# Altium schematic sheet POWER INPUT.SchDoc
size A2; DocumentNumber: 5; SheetNumber: 5; SheetTotal: 19
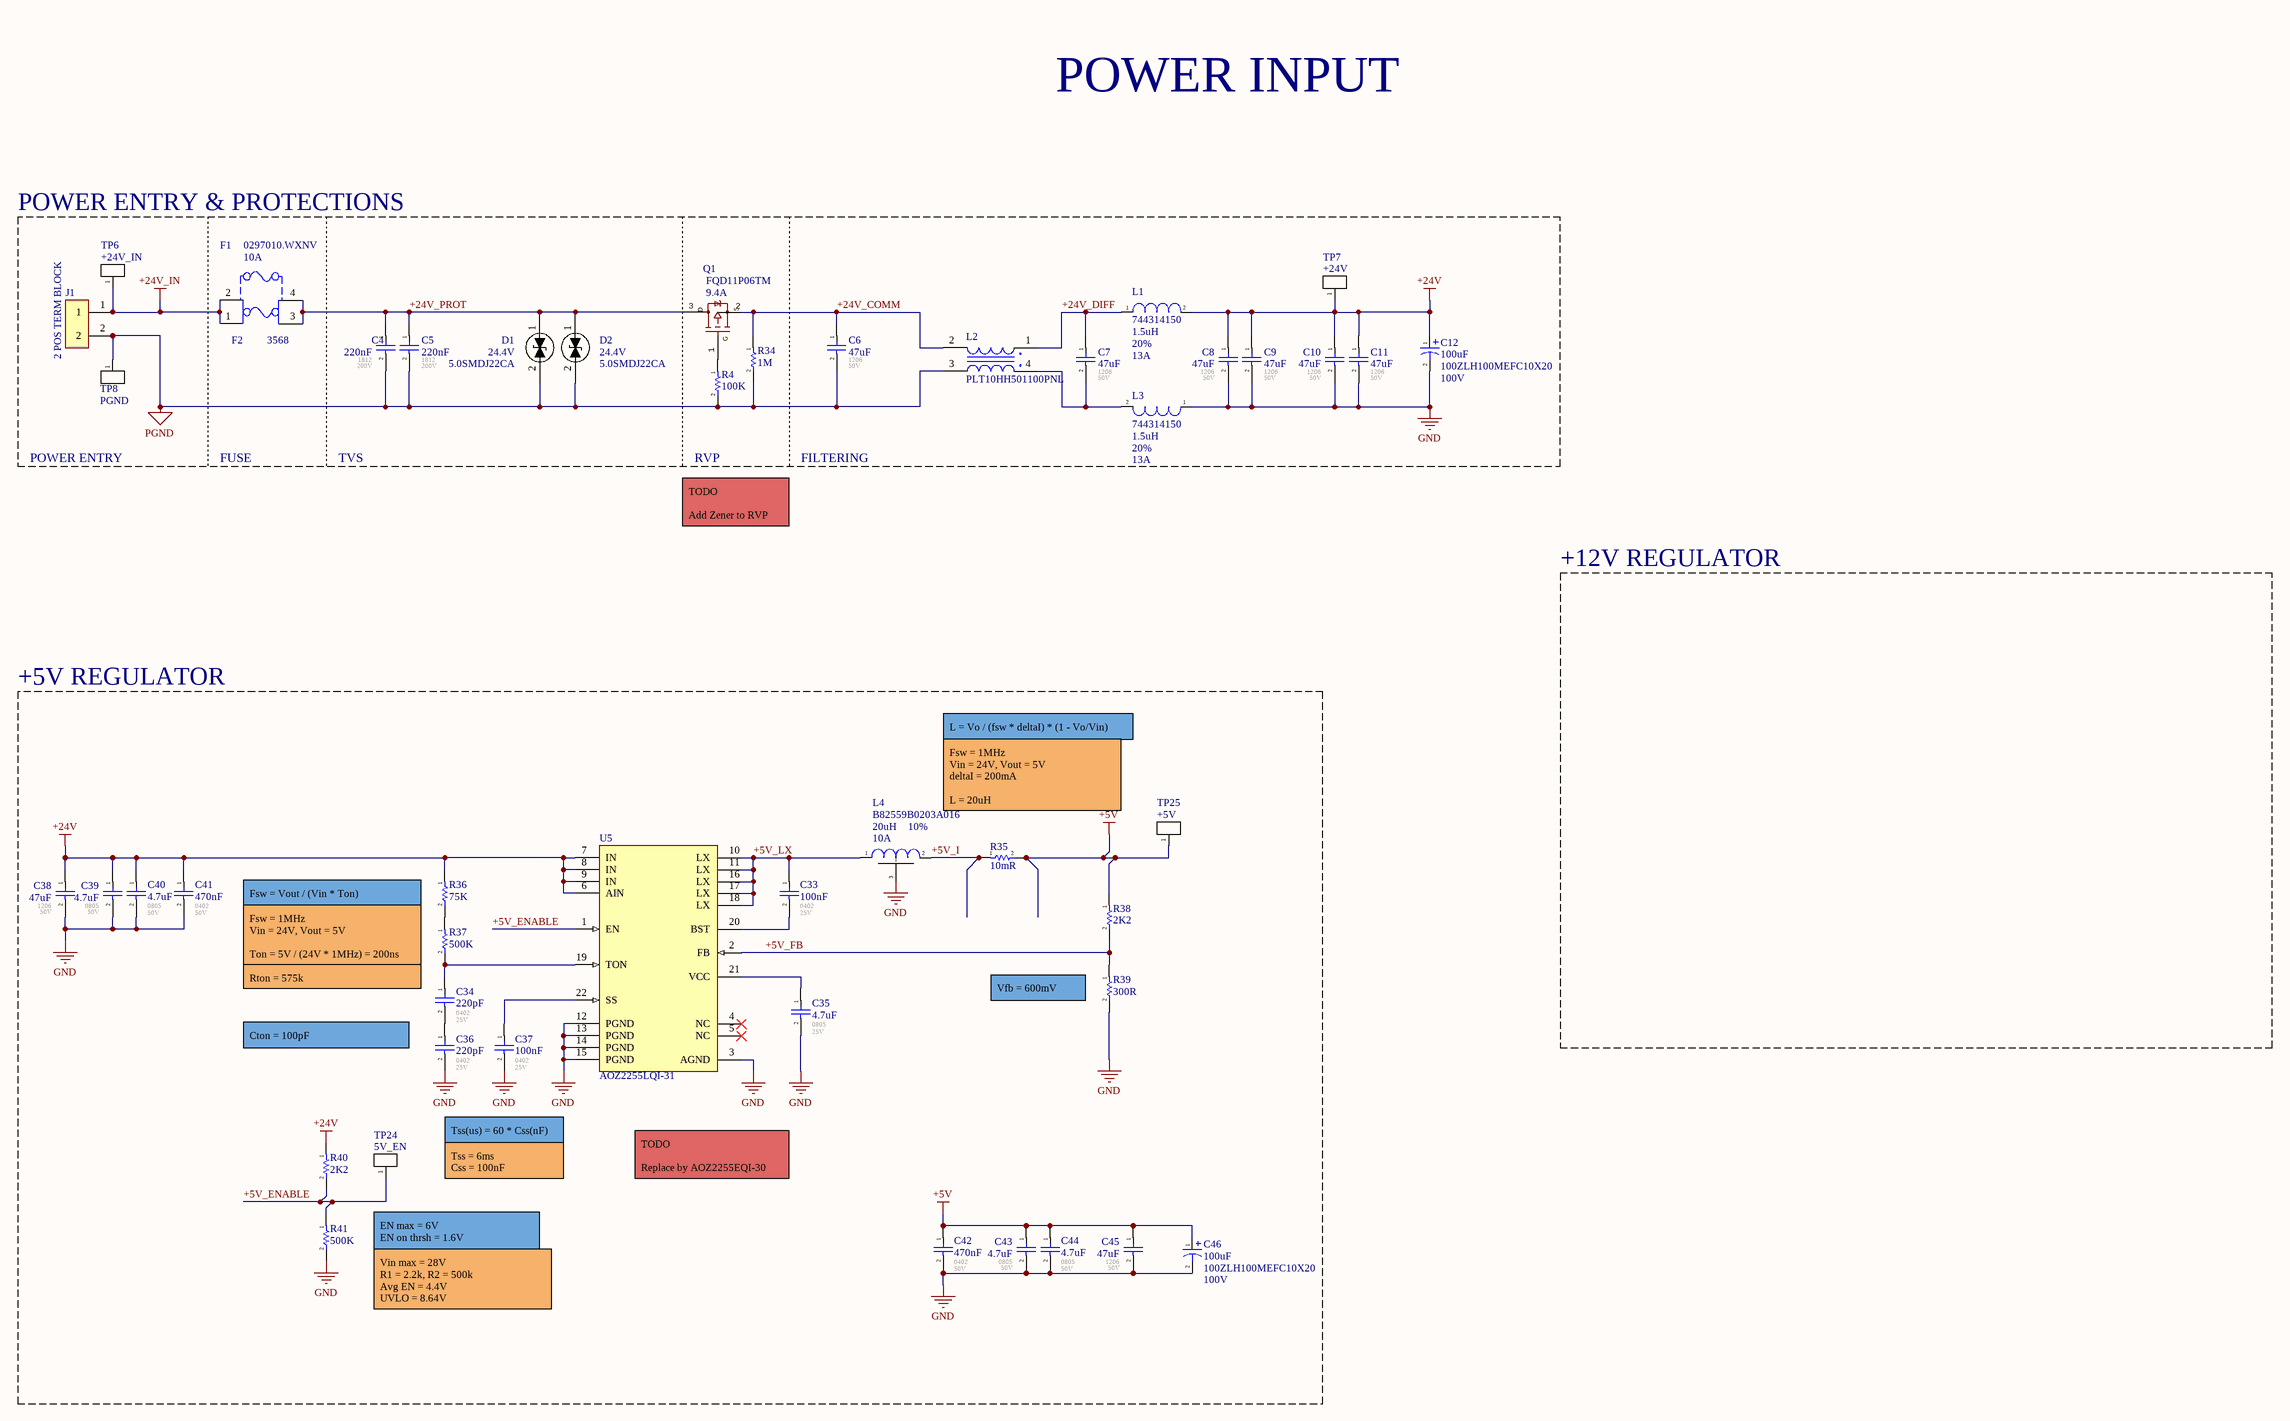
[diagram p0: POWER INPUT.SchDoc]

## Parts
C4  220nF  Voltage - Rated: 200V  Footprint: 1812  [CAP_1812]
C5  220nF  Voltage - Rated: 200V  Footprint: 1812  [CAP_1812]
C6  47uF  Footprint: 1206  Voltage - Rated: 50V  [CAP_1206]
C7  47uF  Footprint: 1206  Voltage - Rated: 50V  [CAP_1206]
C8  47uF  Footprint: 1206  Voltage - Rated: 50V  [CAP_1206]
C9  47uF  Footprint: 1206  Voltage - Rated: 50V  [CAP_1206]
C10  47uF  Footprint: 1206  Voltage - Rated: 50V  [CAP_1206]
C11  47uF  Footprint: 1206  Voltage - Rated: 50V  [CAP_1206]
C12  100uF  Rated Voltage: 100V  [100ZLH100MEFC10X20]
C33  100nF  Footprint: 0402  Voltage - Rated: 25V  [CAP_0402]
C34  220pF  Footprint: 0402  Voltage - Rated: 25V  [CAP_0402]
C35  4.7uF  Footprint: 0805  Voltage - Rated: 25V  [CAP_0805]
C36  220pF  Footprint: 0402  Voltage - Rated: 25V  [CAP_0402]
C37  100nF  Footprint: 0402  Voltage - Rated: 25V  [CAP_0402]
C38  47uF  Footprint: 1206  Voltage - Rated: 50V  [CAP_1206]
C39  4.7uF  Footprint: 0805  Voltage - Rated: 50V  [CAP_0805]
C40  4.7uF  Footprint: 0805  Voltage - Rated: 50V  [CAP_0805]
C41  470nF  Footprint: 0402  Voltage - Rated: 50V  [CAP_0402]
C42  470nF  Footprint: 0402  Voltage - Rated: 50V  [CAP_0402]
C43  4.7uF  Footprint: 0805  Voltage - Rated: 50V  [CAP_0805]
C44  4.7uF  Footprint: 0805  Voltage - Rated: 50V  [CAP_0805]
C45  47uF  Footprint: 1206  Voltage - Rated: 50V  [CAP_1206]
C46  100uF  Rated Voltage: 100V  [100ZLH100MEFC10X20]
D1  5.0SMDJ22CA  Voltage - Breakdown: 24.4V  [DO214AB (SMC)]
D2  5.0SMDJ22CA  Voltage - Breakdown: 24.4V  [DO214AB (SMC)]
F1  0297010.WXNV  Current - Trip: 10A  [0297010.WXNV]
F2  3568  [3568]
J1  2 POS TERM BLOCK  [TERM-2_90_100MIL]
L1  744314150  Inductance: 1.5uH  Tolerance: 20%  Current Rating: 13A  [744314150]
L2  PLT10HH501100PNL  [PLT10HH501100PNL]
L3  744314150  Inductance: 1.5uH  Tolerance: 20%  Current Rating: 13A  [744314150]
L4  B82559B0203A016  Inductance: 20uH  Tolerance: 10%  Current Rating: 10A  [B82559B0203A016]
Q1  FQD11P06TM  Current: 9.4A  [FQD11P06TM]
R4  100K  [RES_0603]
R34  1M  [RES_0402]
R35  10mR  [RES_2512]
R36  75K  [RES_0402]
R37  500K  [RES_0402]
R38  2K2  [RES_0603]
R39  300R  [RES_0603]
R40  2K2  [RES_0603]
R41  500K  [RES_0402]
TP6  +24V_IN  [TP_HOLE]  (no BOM)
TP7  +24V  [TP_HOLE]  (no BOM)
TP8  PGND  [TP_HOLE]  (no BOM)
TP24  5V_EN  [TP_PAD_SMALL]  (no BOM)
TP25  +5V  [TP_HOLE]  (no BOM)
U5  AOZ2255LQI-31  [AOZ2255LQI-31]

## Blocks framed on the sheet
POWER ENTRY & PROTECTIONS: C4-C12 D1 D2 F1 F2 J1 L1-L3 Q1 R4 R34 TP6-TP8
+5V REGULATOR: C33-C46 L4 R35-R41 TP24 TP25 U5

## Nets
+5V: C42.1 C43.1 C44.1 C45.1 C46.1 R35.2 R38.1 TP25.1(A)
+24V: C8.1 C9.1 C10.1 C11.1 C12.1 C38.1 C39.1 C40.1 C41.1 L1.2 R36.1 R40.1 TP7.1(A) U5.6(AIN) U5.7(IN) U5.8(IN) U5.9(IN)
+24V_IN: F2.1 F2.2 J1.1 TP6.1(A)
GND: C8.2 C9.2 C10.2 C11.2 C12.2 C35.2 C36.2 C37.2 C38.2 C39.2 C40.2 C41.2 C42.2 C43.2 C44.2 C45.2 C46.2 L3.1 L4.3(SHIELD) R39.2 R41.2 U5.3(AGND) U5.12(PGND) U5.13(PGND) U5.14(PGND) U5.15(PGND)
PGND: C4.2 C5.2 C6.2 D1.2(C) D2.2(C) J1.2 L2.3 R4.2 R34.2 TP8.1(A)
+5V_ENABLE: R40.2 R41.1 TP24.1(A) U5.1(EN)
+5V_FB: R38.2 R39.1 U5.2(FB)
+5V_I: L4.2 R35.1
+5V_LX: C33.1 L4.1 U5.10(LX) U5.11(LX) U5.16(LX) U5.17(LX) U5.18(LX)
+24V_COMM: C6.1 L2.2 Q1.2(S) R34.1
+24V_DIFF: C7.1 L1.1 L2.1
+24V_PROT: C4.1 C5.1 D1.1(A) D2.1(A) F2.3 F2.4 Q1.3(D)
NetC7_2: C7.2 L2.4 L3.2
NetC33_2: C33.2 U5.20(BST)
NetC34_1: C34.1 R37.2 U5.19(TON)
NetC34_2: C34.2 C36.1
NetC35_1: C35.1 U5.21(VCC)
NetC37_1: C37.1 U5.22(SS)
NetQ1_1: Q1.1(G) R4.1
NetR36_2: R36.2 R37.1

Not connected (* = marked no-connect by the designer): U5 4(NC)* 5(NC)*

## Notes on the sheet
- POWER INPUT
- POWER ENTRY
- FUSE
- TVS
- RVP
- FILTERING
- TODO
  Add Zener to RVP
- +12V REGULATOR
- L = Vo / (fsw * deltaI) * (1 - Vo/Vin)
- Fsw = 1MHz
  Vin = 24V, Vout = 5V
  deltaI = 200mA
  L = 20uH
- Fsw = Vout / (Vin * Ton)
- Fsw = 1MHz
  Vin = 24V, Vout = 5V
  Ton = 5V / (24V * 1MHz) = 200ns
- Rton = 575k
- (near R39) Vfb = 600mV
- Cton = 100pF
- Tss(us) = 60 * Css(nF)
- Tss = 6ms
  Css = 100nF
- TODO
  Replace by AOZ2255EQI-30
- EN max = 6V
  EN on thrsh = 1.6V
- Vin max = 28V
  R1 = 2.2k, R2 = 500k
  Avg EN = 4.4V
  UVLO = 8.64V

## Library data of the parts
C4-C11 C33-C45 = CAP_CER: Generic SMT Ceramic Capacitor; Operating Temperature: *; Tolerance: *; Mfr: *; ComponentLink1Description: Digikey; ComponentLink1URL: [Digikey Link]; Digikey Part No: *; ComponentLink2Description: Datasheet; ComponentLink2URL: [Datasheet Link]
C12 C46 = CAP_100ZLH100MEFC10X20: CAP 100uF 20% 100V T/H; Mfr: Rubycon; Impedance: 120mR; Tolerance: 20%; Operating Temperature: -40C - 105C; ComponentLink1Description: Digikey; ComponentLink1URL: https://www.digikey.ca/en/products/detail/rubycon/100ZLH100MEFC10X20/3563824; ComponentLink2Description: Mouser; ComponentLink2URL: https://www.mouser.ca/ProductDetail/Rubycon/100ZLH100MEFC10X20; Digikey Part Number: 1189-1887-ND; Created By: Pascal-Emmanuel Lachance; ComponentLink3Description: Datasheet; ComponentLink3URL: https://www.rubycon.co.jp/wp-content/uploads/catalog-aluminum/ZLH.pdf; ComponentLink4Description: Octoparts; ComponentLink4URL: https://octopart.com/100zlh100mefc10x20-rubycon-19941711; Height: 22mm; Manufacturer Part Number: 100ZLH100MEFC10X20
D1 D2 = DIODE_5.0SMDJ22CA: TVS Diode 24.4V; Mfr: Littelfuse; Voltage - Reverse: 22V; Current: 141A Peak; Operating Temperature: -65C - 150C; Package / Case: SMC; Created By: Pascal-Emmanuel Lachance; ComponentLink1Description: Datasheet; ComponentLink1URL: https://www.littelfuse.com/~/media/electronics/datasheets/tvs_diodes/littelfuse_tvs_diode_5_0smdj_datasheet.pdf.pdf; ComponentLink2Description: Mfr page; ComponentLink2URL: https://www.littelfuse.com/products/tvs-diodes/surface-mount/5_0smdj/5_0smdj22ca.aspx; ComponentLink3Description: Digikey; ComponentLink3URL: https://www.digikey.ca/en/products/detail/littelfuse-inc/5-0SMDJ22CA/2024320; ComponentLink4Description: Mouser; ComponentLink4URL: https://www.mouser.ca/ProductDetail/Littelfuse/50SMDJ22CA; Supplier 1: Digi-Key; Supplier 2: Mouser; Supplier Part Number 1: F10850CT-ND; Supplier Part Number 2: 652-5.0SMDJ22CA
F1 = FUSE_0297010.WXNV: FUSE AUTO 10A 32V BLADE MINI; Mfr: Littelfuse; Current - Max: 40A; Time to Trip: 100ms; Resistance: 7.42mR; Rule: UNIONINDEX=0|RULEKIND=ComponentClearance|NETSCOPE=AnyNet|LAYERKIND=SameLayer|NAME=Schematic Component Clearance Constraint|GAP=-1mil|COLLISIONCHECKMODE=3|VERTICALGAP=10mil|SHOWDISTANCES=FALSE|UNIT=Imperial; Voltage Rating: 32V; Operating Temperature: -40C - 125C; Package / Case: BLADE MINI AUTO; Current - Hold: 10A; ComponentLink1Description: Datasheet; ComponentLink1URL: https://www.littelfuse.com/~/media/automotive/datasheets/fuses/passenger-car-and-commercial-vehicle/blade-fuses/littelfuse_mini_datasheet.pdf; ComponentLink2Description: Digikey; ComponentLink2URL: https://www.digikey.ca/en/products/detail/littelfuse-inc/0297010-WXNV/146591; Created By: Pascal-Emmanuel Lachance; ComponentLink3Description: Mouser; ComponentLink3URL: https://www.mouser.ca/ProductDetail/Littelfuse/0297010WXNV; ComponentLink4Description: Octopart; ComponentLink4URL: https://octopart.com/0297010.wxnv-littelfuse-566872
F2 = FUSE_HOLDER_3568: FUSE HOLDER BLADE; Mfr: Keystone; Voltage Rating: 500V; Current - Max: 30A; Operating Temperature: -50C - 145C; Created By: Pascal-Emmanuel Lachance
J1 = TERM_BLOCK-2
L1 L3 = IND_744314150: FIXED IND 1.5UH 13A 4.3 MOHM SMD; Mfr: Wurth; Resistance: 4.3mR; Operating Temperature: -40C - 150C; Created By: Pascal-Emmanuel Lachance; ComponentLink1Description: Digikey; ComponentLink1URL: https://www.digikey.ca/en/products/detail/w%C3%BCrth-elektronik/744314150/1638563; ComponentLink2Description: Mouser; ComponentLink2URL: https://www.mouser.ca/ProductDetail/Wurth-Elektronik/744314150; ComponentLink3Description: Datasheet; ComponentLink3URL: https://www.we-online.com/katalog/datasheet/744314150.pdf
L2 = IND_PLT10HH501100PNL: 2 Line Common Mode Choke Surface Mount 500 Ohms @ 10MHz 10A DCR 4.1mOhm; mfr: Murata; Impedance @ 10MHz: 500R; DC Resistance: 4.1mR; Voltage Rating: 100V; Rating: Automotive (AEC-Q200); Value: *; Current Rating: 10A; Operating Temperature: -55C - 105C; Created By: Pascal-Emmanuel Lachance; ComponentLink1Description: Datasheet; ComponentLink1URL: https://www.murata.com/en-eu/products/productdata/8796754935838/QFLB9101.pdf; ComponentLink2Description: Mfr page; ComponentLink2URL: https://www.murata.com/en-us/products/productdetail?partno=PLT10HH501100PN%23; ComponentLink3Description: Digikey; ComponentLink3URL: https://www.digikey.ca/en/products/detail/murata-electronics/PLT10HH501100PNL/6196056; ComponentLink4Description: Mouser; ComponentLink4URL: https://www.mouser.ca/ProductDetail/Murata-Electronics/PLT10HH501100PNL
L4 = IND_B82559B0203A016: 20uH Shielded 10A Inductor; Mfr: TDK; Material: Ferrite; Resistance: 12.1mR; Operating Temperature: -40C to 150C; Created By: Pascal-Emmanuel Lachance; Rating: AEC-Q200; ComponentLink1Description: Datasheet; ComponentLink1URL: https://media.digikey.com/pdf/Data%20Sheets/TDK%20PDFs/B82559BxA016_Series_DS.pdf; ComponentLink2Description: Digikey; ComponentLink2URL: https://www.digikey.ca/en/products/detail/epcos-tdk-electronics/B82559B0203A016/13165560; ComponentLink3Description: Mouser; ComponentLink3URL: https://www.mouser.ca/ProductDetail/EPCOS-TDK/B82559B0203A016; ComponentLink4Description: Mfr page; ComponentLink4URL: https://product.tdk.com/en/search/inductor/inductor/smd/info?part_no=B82559B0203A016; ComponentLink5Description: Octoparts; ComponentLink5URL: https://octopart.com/b82559b0203a016-epcos-111982021; Supplier 1: Digi-Key; Supplier Part Number 1: 495-B82559B0203A016CT-ND
Q1 = TRANS_FQD11P06TM: MOSFET P-CH 60V 9.4A DPAK; Mfr: ON Semiconductor; Rds ON: 185mOhms; Vgs: +-30V; Package / Case: DPAK; Vds: 60V; Operating Temperature: -55C - 150C; Digikey Part Number: FQD11P06TMCT-ND; ComponentLink1Description: Digikey; ComponentLink1URL: https://www.digikey.ca/en/products/detail/on-semiconductor/FQD11P06TM/1054286; ComponentLink2Description: Mouser; ComponentLink2URL: https://www.mouser.ca/ProductDetail/ON-Semiconductor-Fairchild/FQD11P06TM
R4 R34 = RESISTOR: Power: 1/16W; Tolerance: 10%; Automotive: *; Operating Temperature: *; # Digikey: *; ComponentLink1Description: Digikey; ComponentLink1URL: *; # Manufacturer: *; Package / Case: 0603
R35 = RESISTOR: Power: 2W; Tolerance: 1%; Automotive: *; Operating Temperature: *; # Digikey: *; ComponentLink1Description: Digikey; ComponentLink1URL: *; # Manufacturer: *; Package / Case: 2512
R36 R37 R41 = RESISTOR: Power: 1/10W; Tolerance: 10%; Automotive: *; Operating Temperature: *; # Digikey: *; ComponentLink1Description: Digikey; ComponentLink1URL: *; # Manufacturer: *; Package / Case: 0402
R38 R40 = RESISTOR: Power: 1/16W; Tolerance: 2%; Automotive: *; Operating Temperature: *; # Digikey: *; ComponentLink1Description: Digikey; ComponentLink1URL: *; # Manufacturer: *; Package / Case: 0603
R39 = RESISTOR: Power: 1/8W; Tolerance: 2%; Automotive: *; Operating Temperature: *; # Digikey: *; ComponentLink1Description: Digikey; ComponentLink1URL: *; # Manufacturer: *; Package / Case: 0603
TP6-TP8 TP24 TP25 = TESTPOINT: Test Point
U5 = IC_AOZ2255LQI-31: Buck Switching Regulator IC Positive Adjustable 0.6V 1 Output 12A 22-PowerVFQFN; Mfr: Alpha & Omega Semiconductor; Min Input Voltage: 6.5V; Max Input Voltage: 28V; Max Output Voltage: 23.8V; Min Output Voltage: 0.6V; Max Output Current: 12A; Operating Temperature: -40C to 85C; Package: PowerVFQFN-22 (4x4); Supplier 1: Digi-Key; Supplier Part Number 1: 785-AOZ2255LQI-31TR-ND; ComponentLink1Description: Digikey; ComponentLink1URL: https://www.digikey.ca/en/products/detail/alpha-omega-semiconductor-inc/AOZ2255LQI-31/12180202; ComponentLink2Description: Datasheet; ComponentLink2URL: http://aosmd.com/res/data_sheets/AOZ2255LQI-31.pdf; ComponentLink3Description: Octoparts; ComponentLink3URL: https://octopart.com/aoz2255lqi-31-alpha+%26+omega+semiconductor-109142852